# Altium schematic sheet MCU.SchDoc
size A4; CheckedBy: CT-Energys; Author: CT-Energys; CompanyName: HTD COMPANY LIMITED; DrawnBy: CHITOAN; Engineer: CHITOAN; Organization: Altium Limited; Address1: HO CHI MINH CITY; Address2: VIETNAM
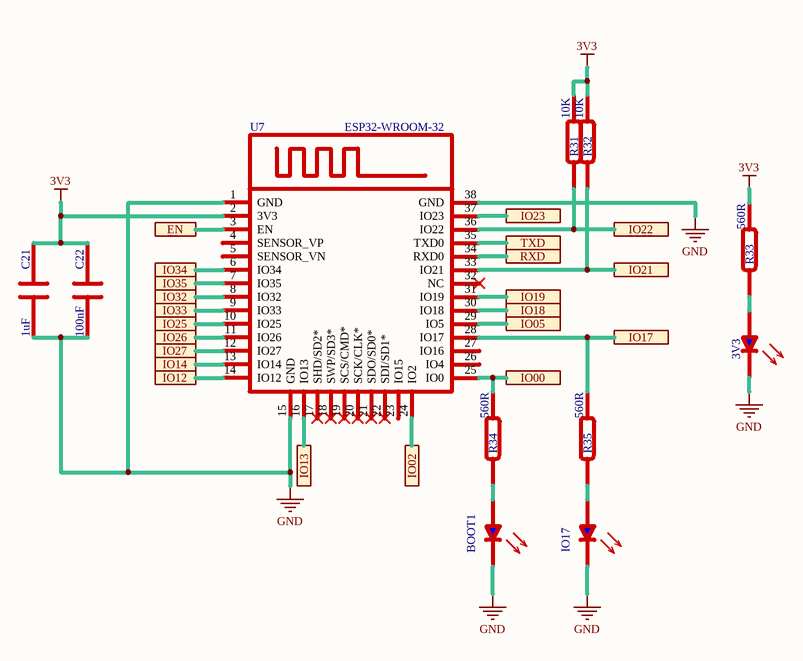
[diagram p0: MCU.SchDoc]

## Parts
BOOT1  LED-BLUE  [LED-0603-BLUE]  (value not drawn)
C21  1uF  [C0603]
C22  100nF  [C0603]
IO1  IO17  [LED-0603-BLUE]
L3  3V3  [LED-0603-BLUE]
R31  10K  [R0603]
R32  10K  [R0603]
R33  560R  [R0603]
R34  560R  [R0603]
R35  560R  [R0603]
U7  ESP32-WROOM-32  [ESP32-WROOM-32]

## Ports
EN, IO00, IO02, IO05, IO12, IO13, IO14, IO17, IO18, IO19, IO21, IO22, IO23, IO25, IO26, IO27, IO32, IO33, IO34, IO35, RXD, TXD

## Nets
3V3: C21.2 C22.2 R31.1 R32.1 R33.1 U7.2(3V3)
GND: BOOT1.2(K) C21.1 C22.1 IO1.2(K) L3.2(K) U7.1(GND) U7.15(GND) U7.38(GND)
EN: U7.3(EN) ; port EN
IO00: R34.1 U7.25(IO0) ; port IO00
IO02: U7.24(IO2) ; port IO02
IO05: U7.29(IO5) ; port IO05
IO12: U7.14(IO12) ; port IO12
IO13: U7.16(IO13) ; port IO13
IO14: U7.13(IO14) ; port IO14
IO17: R35.1 U7.28(IO17) ; port IO17
IO18: U7.30(IO18) ; port IO18
IO19: U7.31(IO19) ; port IO19
IO21: R32.2 U7.33(IO21) ; port IO21
IO22: R31.2 U7.36(IO22) ; port IO22
IO23: U7.37(IO23) ; port IO23
IO25: U7.10(IO25) ; port IO25
IO26: U7.11(IO26) ; port IO26
IO27: U7.12(IO27) ; port IO27
IO32: U7.8(IO32) ; port IO32
IO33: U7.9(IO33) ; port IO33
IO34: U7.6(IO34) ; port IO34
IO35: U7.7(IO35) ; port IO35
RXD: U7.34(RXD0) ; port RXD
TXD: U7.35(TXD0) ; port TXD
NetBOOT1_1: BOOT1.1(A) R34.2
NetIO1_1: IO1.1(A) R35.2
NetL3_1: L3.1(A) R33.2

Not connected (* = marked no-connect by the designer): U7 4(SENSOR_VP) 5(SENSOR_VN) 17(SHD/SD2*)* 18(SWP/SD3*)* 19(SCS/CMD*)* 20(SCK/CLK*)* 21(SDO/SD0*)* 22(SDI/SD1*)* 23(IO15) 26(IO4) 27(IO16) 32(NC)* 39(GND)

## Notes on the sheet
- Title
- Size:
- Date:
- A4
- Number:
- Time:
- Revision:
- Design by:
- Company:
- File:

## Library data of the parts
BOOT1 IO1 L3 = LED-Blue: Blue Light Emiter Diode
C21 C22 = CAP-CER: Ceramic Capacitor
R31-R35 = Resistor
U7 = ESP32-WROOM-32: ESP32 powerfull micro controller CHIP; ComponentLink1Description: ESP32-WROOM-32E-N4; ComponentLink1URL: https://www.espressif.com/sites/default/files/documentation/esp32-wroom-32e_esp32-wroom-32ue_datasheet_en.pdf